# EAGLE schematic Elecctronic_Dice (EAGLE 7.7.0)

## Sheet 1 of 2
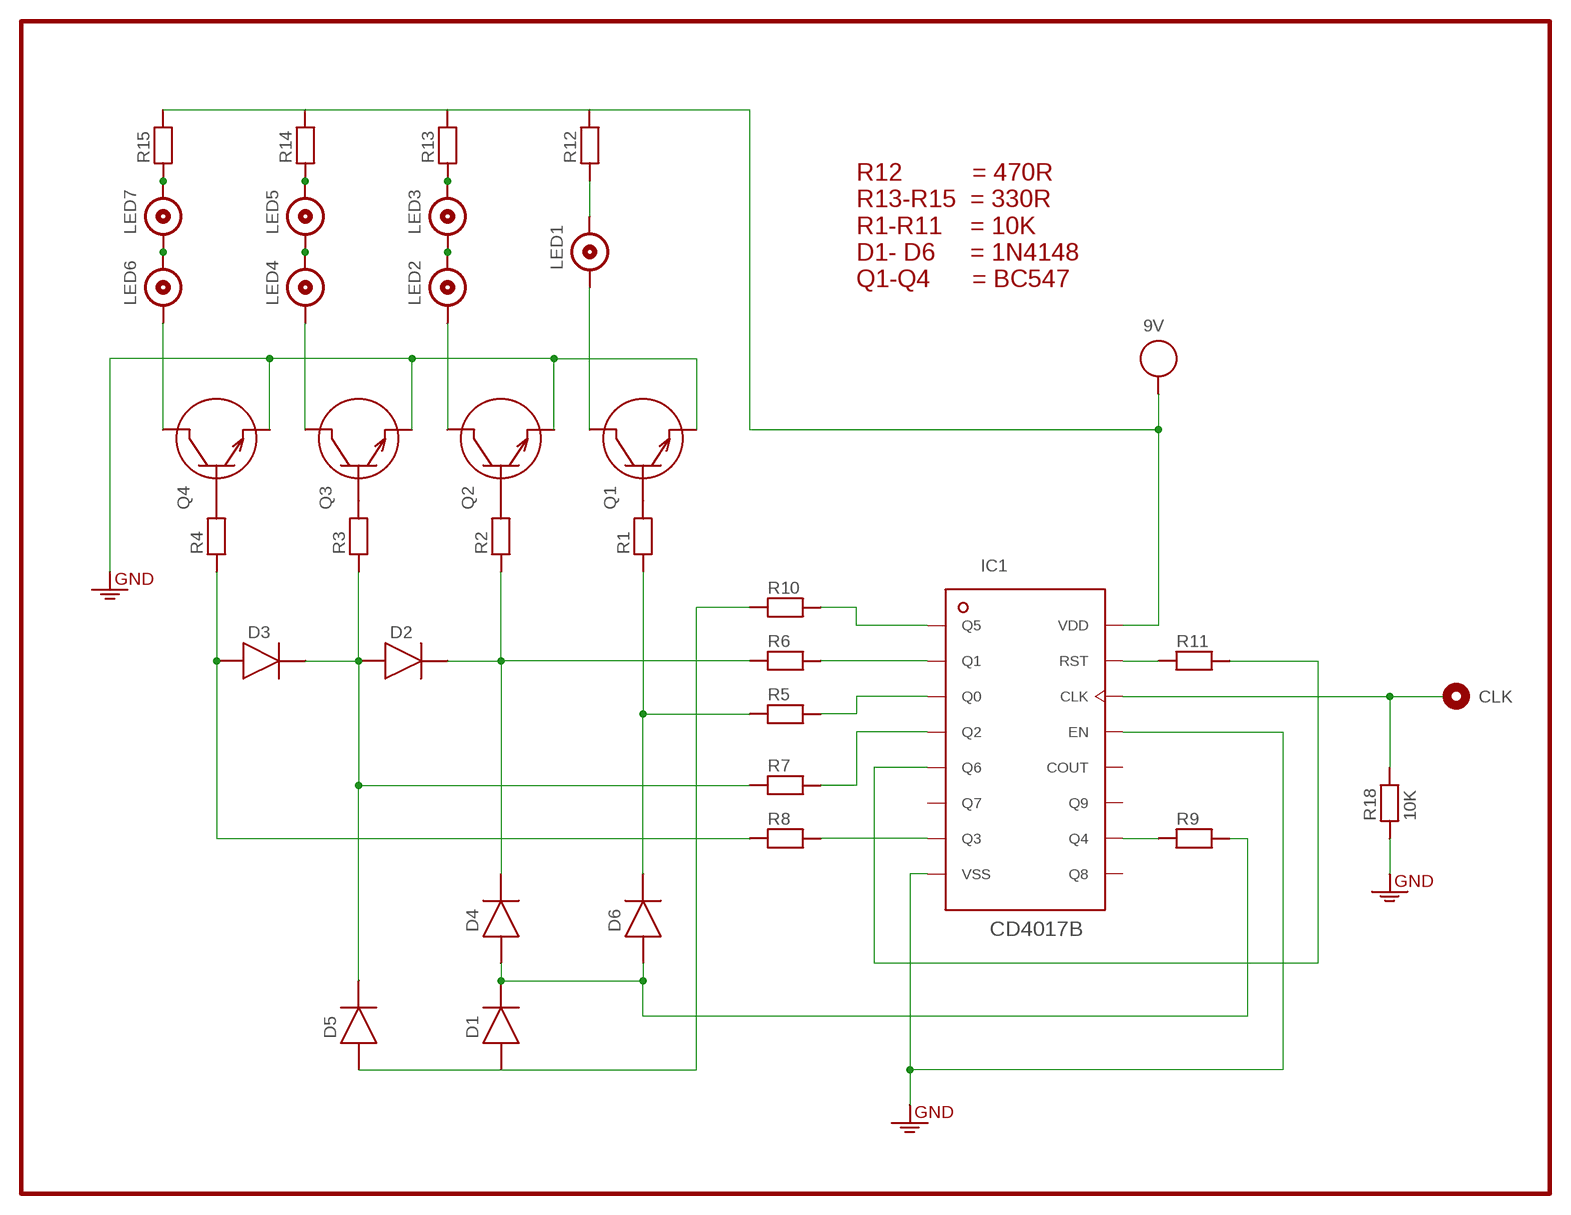
[diagram p0: schematic, sheet 1]

### Parts
CLK  POINT  [1POINT]
D1  DIODE_NORMAL  [DIO_3G]
D2  DIODE_NORMAL  [DIO_3G]
D3  DIODE_NORMAL  [DIO_3G]
D4  DIODE_NORMAL  [DIO_3G]
D5  DIODE_NORMAL  [DIO_3G]
D6  DIODE_NORMAL  [DIO_3G]
IC1  CD4017B  [16PIN_IC]
LED1  LED  [LED_OG]
LED2  LED  [LED_OG]
LED3  LED  [LED_OG]
LED4  LED  [LED_OG]
LED5  LED  [LED_OG]
LED6  LED  [LED_OG]
LED7  LED  [LED_OG]
Q1  TRANSISTOR_NPN  [TRANSISTOR]
Q2  TRANSISTOR_NPN  [TRANSISTOR]
Q3  TRANSISTOR_NPN  [TRANSISTOR]
Q4  TRANSISTOR_NPN  [TRANSISTOR]
R1  RESISTOR_NORMAL  [RES_3G]
R2  RESISTOR_NORMAL  [RES_3G]
R3  RESISTOR_NORMAL  [RES_3G]
R4  RESISTOR_NORMAL  [RES_3G]
R5  RESISTOR_NORMAL  [RES_3G]
R6  RESISTOR_NORMAL  [RES_3G]
R7  RESISTOR_NORMAL  [RES_3G]
R8  RESISTOR_NORMAL  [RES_3G]
R9  RESISTOR_NORMAL  [RES_3G]
R10  RESISTOR_NORMAL  [RES_3G]
R11  RESISTOR_NORMAL  [RES_3G]
R12  RESISTOR_NORMAL  [RES_3G]
R13  RESISTOR_NORMAL  [RES_3G]
R14  RESISTOR_NORMAL  [RES_3G]
R15  RESISTOR_NORMAL  [RES_3G]
R18  10K  RESISTOR_NORMAL  [RES_3G]
U$1  GND  [1POINT]
U$2  GND  [1POINT]
U$3  9V  VCC  [1POINT]
U$5  GND  [1POINT]

### Nets
N$1: IC1.P$2(Q1) R6.P$5
N$2: IC1.P$3(Q0) R5.P$5
N$3: IC1.P$4(Q2) R7.P$5
N$4: IC1.P$7(Q3) R8.P$5
N$5: Q1.P$2 R1.P$5
N$6: D3.P R4.P$3 R8.P$3
N$7: D2.P D3.N D5.N R3.P$3 R7.P$3
N$8: IC1.P$10(Q4) R9.P$3
N$9: LED2.P$1 LED3.P$2
N$10: D2.N D4.N R2.P$3 R6.P$3
N$11: Q2.P$2 R2.P$5
N$12: IC1.P$5(Q6) R11.P$5
N$13: Q3.P$2 R3.P$5
N$14: IC1.P$16(VDD) R12.P$5 R15.P$5 U$3.P$1
N$15: Q4.P$2 R4.P$5
N$16: IC1.P$8(VSS) IC1.P$13(EN) U$2.P$1
N$17: IC1.P$15(RST) R11.P$3
N$18: IC1.P$1(Q5) R10.P$5
N$19: D1.P D5.P R10.P$3
N$20: D6.N R1.P$3 R5.P$3
N$21: D1.N D4.P D6.P R9.P$5
N$22: Q1.P$1 Q2.P$1 Q3.P$1 Q4.P$1 U$1.P$1
N$23: LED4.P$1 LED5.P$2
N$24: LED6.P$1 LED7.P$2
N$25: LED3.P$1 R13.P$3
N$26: LED5.P$1 R14.P$3
N$27: LED7.P$1 R15.P$3
N$28: LED1.P$1 R12.P$3
N$29: LED6.P$2 Q4.P$3
N$30: LED4.P$2 Q3.P$3
N$31: LED2.P$2 Q2.P$3
N$32: LED1.P$2 Q1.P$3
N$33: CLK.P$1 IC1.P$14(CLK) R18.P$5
N$39: R18.P$3 U$5.P$1
Unconnected: IC1.P$6(Q7) IC1.P$9(Q8) IC1.P$11(Q9) IC1.P$12(COUT) R13.P$5 R14.P$5

### Notes on the sheet
- R12          = 470R
  R13-R15  = 330R
  R1-R11    = 10K
  D1- D6     = 1N4148
  Q1-Q4      = BC547

## Sheet 2 of 2
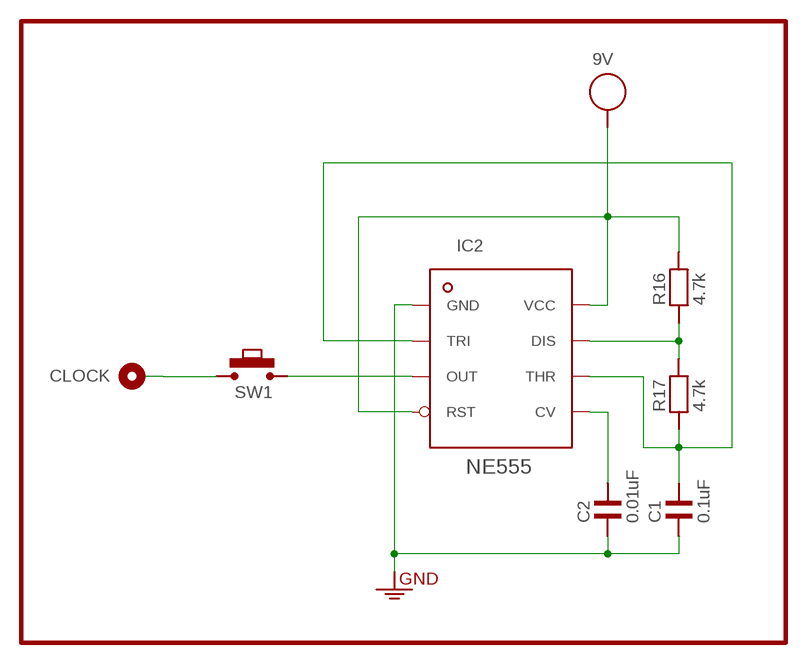
[diagram p1: schematic, sheet 2]

### Parts
9V  9V  VCC  [1POINT]
C1  0.1uF  CAP_NPOL  [2POINT]
C2  0.01uF  CAP_NPOL  [2POINT]
CLOCK  POINT  [1POINT]
IC2  NE555  [8PIN_IC]
R16  4.7k  RESISTOR_NORMAL  [RES_3G]
R17  4.7k  RESISTOR_NORMAL  [RES_3G]
SW1  PUSHSWITCH  [PUSHSWITCH]
U$4  GND  [1POINT]

### Nets
N$34: 9V.P$1 IC2.P$4(RST) IC2.P$8(VCC) R16.P$5
N$35: C1.P$2 IC2.P$2(TRI) IC2.P$6(THR) R17.P$3
N$36: C1.P$1 C2.P$1 IC2.P$1(GND) U$4.P$1
N$37: C2.P$2 IC2.P$5(CV)
N$38: IC2.P$7(DIS) R16.P$3 R17.P$5
N$40: IC2.P$3(OUT) SW1.P$3 SW1.P$4
N$41: CLOCK.P$1 SW1.P$1 SW1.P$2

## Library data of the parts
9V = SAM Labs Basics:VCC: Voltage Source Point.
C1 C2 = SAM Labs Basics:CAP_NPOL: Non-Polarized Capacitor.
CLK CLOCK = SAM Labs Basics:POINT: POINT.
D1-D6 = SAM Labs Basics:DIODE_NORMAL: Normal Diode.
IC1 = SAM Labs Components:CD4017B: CD4017B Decade Counter.
IC2 = SAM Labs Components:NE555: NE555 Timer IC.
LED1-LED7 = SAM Labs Basics:LED: LED.
Q1-Q4 = SAM Labs Basics:TRANSISTOR_NPN: NPN Transistor.
R1-R18 = SAM Labs Basics:RESISTOR_NORMAL: Resistor.
SW1 = SAM Labs Basics:PUSHSWITCH: Pushbotton.
U$1 U$2 U$5 = SAM Labs Components:GND: GROUND POINT.
U$3 = SAM Labs Components:VCC: VOLTAGE SOURCE POINT.
U$4 = SAM Labs Basics:GND: Ground point.